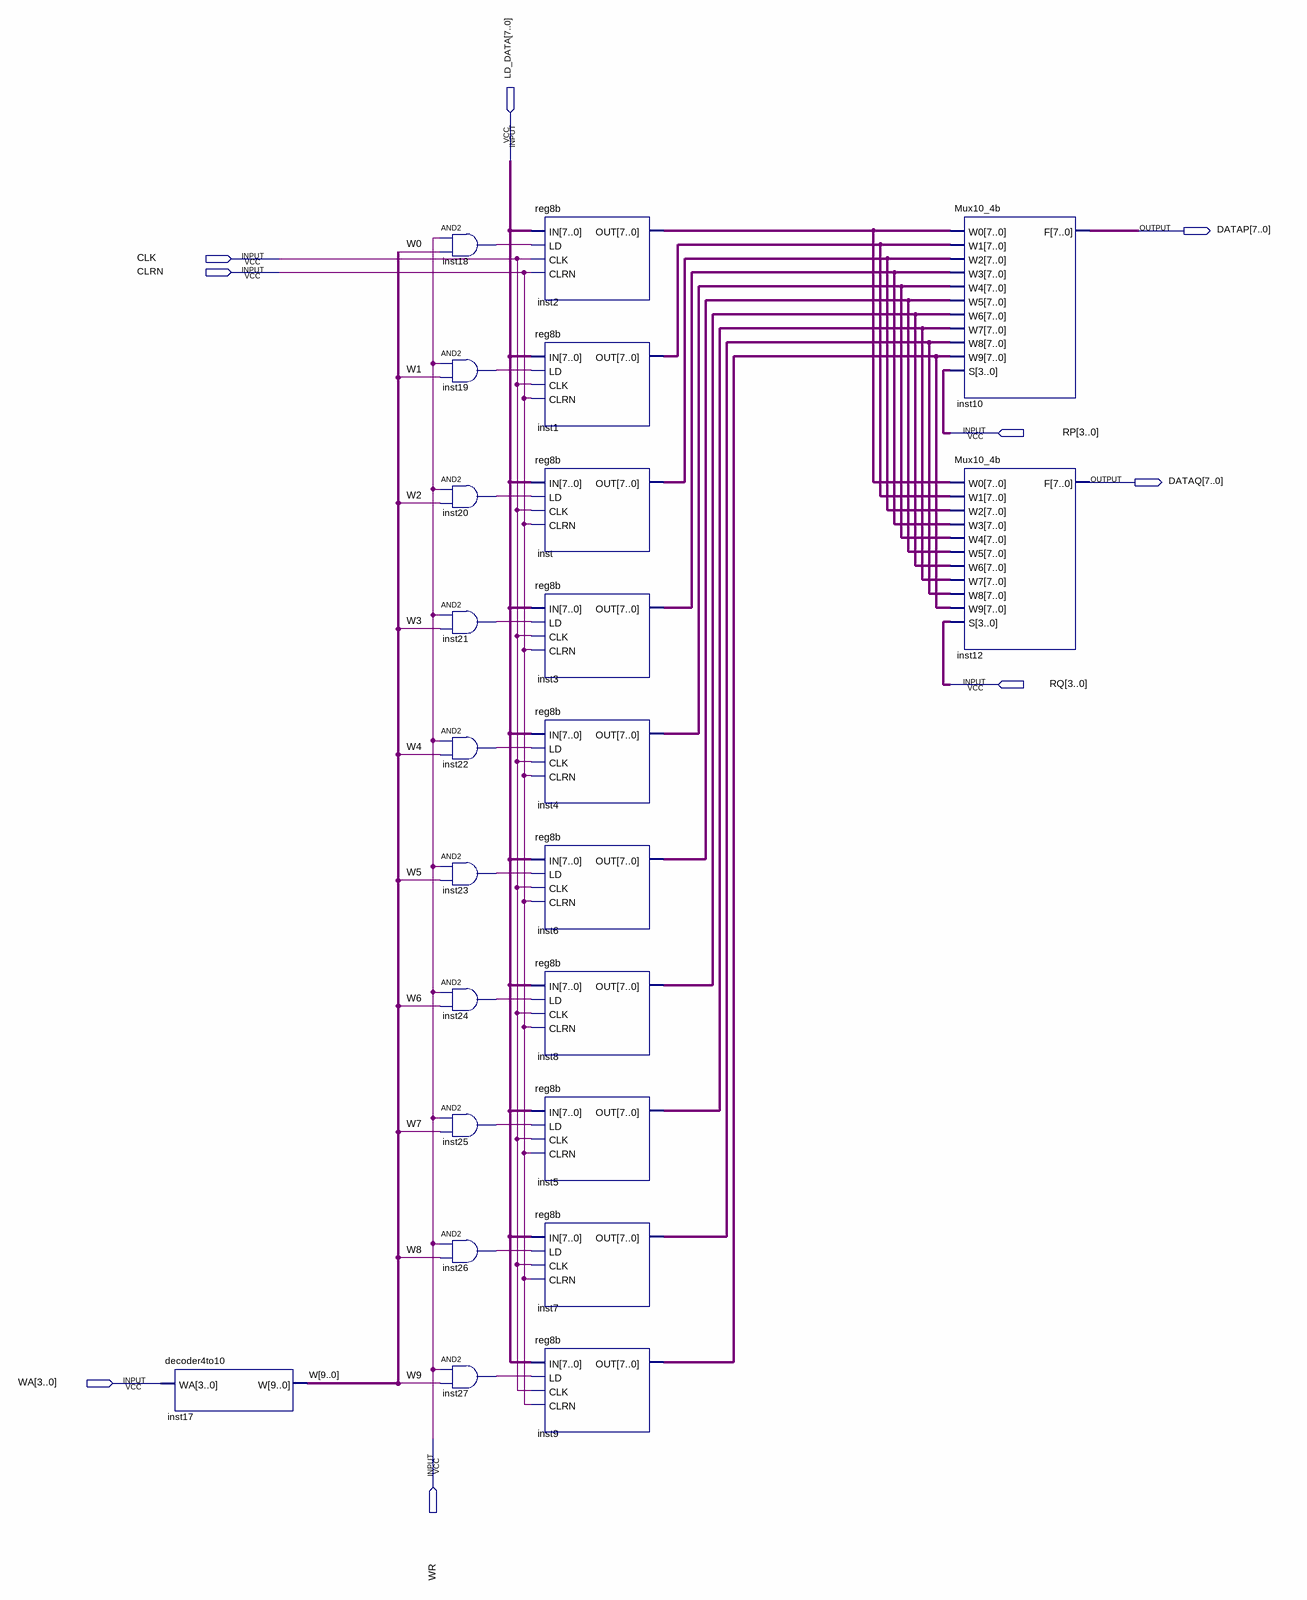
[diagram p0: schematic sheet]
// Quartus schematic regfile.bdf as structural Verilog: 23 symbols, 9 pins
module regfile (
  input  [7:0] LD_DATA,
  input  CLK,
  input  CLRN,
  input  [3:0] RP,
  input  [3:0] RQ,
  input  [3:0] WA,
  input  WR,
  output [7:0] DATAP,
  output [7:0] DATAQ
);

  wire inst18_out, inst19_out, inst20_out, inst21_out, inst22_out, inst23_out, inst24_out, inst25_out,
       inst26_out, inst27_out;
  wire [7:0] inst1_out, inst2_out, inst3_out, inst4_out, inst5_out, inst6_out, inst7_out, inst8_out,
       inst9_out, inst_out;
  wire [9:0] W;

  decoder4to10 inst17 (.WA(WA), .W(W));
  and inst18 (inst18_out, WR, W[0]);
  and inst19 (inst19_out, WR, W[1]);
  and inst20 (inst20_out, WR, W[2]);
  and inst21 (inst21_out, WR, W[3]);
  and inst22 (inst22_out, WR, W[4]);
  and inst23 (inst23_out, WR, W[5]);
  and inst24 (inst24_out, WR, W[6]);
  and inst25 (inst25_out, WR, W[7]);
  and inst26 (inst26_out, WR, W[8]);
  and inst27 (inst27_out, WR, W[9]);
  reg8b inst2 (.IN(LD_DATA), .LD(inst18_out), .CLK(CLK), .CLRN(CLRN), .OUT(inst2_out));
  reg8b inst1 (.IN(LD_DATA), .LD(inst19_out), .CLK(CLK), .CLRN(CLRN), .OUT(inst1_out));
  reg8b inst (.IN(LD_DATA), .LD(inst20_out), .CLK(CLK), .CLRN(CLRN), .OUT(inst_out));
  reg8b inst3 (.IN(LD_DATA), .LD(inst21_out), .CLK(CLK), .CLRN(CLRN), .OUT(inst3_out));
  reg8b inst4 (.IN(LD_DATA), .LD(inst22_out), .CLK(CLK), .CLRN(CLRN), .OUT(inst4_out));
  reg8b inst6 (.IN(LD_DATA), .LD(inst23_out), .CLK(CLK), .CLRN(CLRN), .OUT(inst6_out));
  reg8b inst8 (.IN(LD_DATA), .LD(inst24_out), .CLK(CLK), .CLRN(CLRN), .OUT(inst8_out));
  reg8b inst5 (.IN(LD_DATA), .LD(inst25_out), .CLK(CLK), .CLRN(CLRN), .OUT(inst5_out));
  reg8b inst7 (.IN(LD_DATA), .LD(inst26_out), .CLK(CLK), .CLRN(CLRN), .OUT(inst7_out));
  reg8b inst9 (.IN(LD_DATA), .LD(inst27_out), .CLK(CLK), .CLRN(CLRN), .OUT(inst9_out));
  Mux10_4b inst10 (
    .W0(inst2_out), .W1(inst1_out), .W2(inst_out), .W3(inst3_out), .W4(inst4_out), .W5(inst6_out),
    .W6(inst8_out), .W7(inst5_out), .W8(inst7_out), .W9(inst9_out), .S(RP), .F(DATAP));
  Mux10_4b inst12 (
    .W0(inst2_out), .W1(inst1_out), .W2(inst_out), .W3(inst3_out), .W4(inst4_out), .W5(inst6_out),
    .W6(inst8_out), .W7(inst5_out), .W8(inst7_out), .W9(inst9_out), .S(RQ), .F(DATAQ));
endmodule
